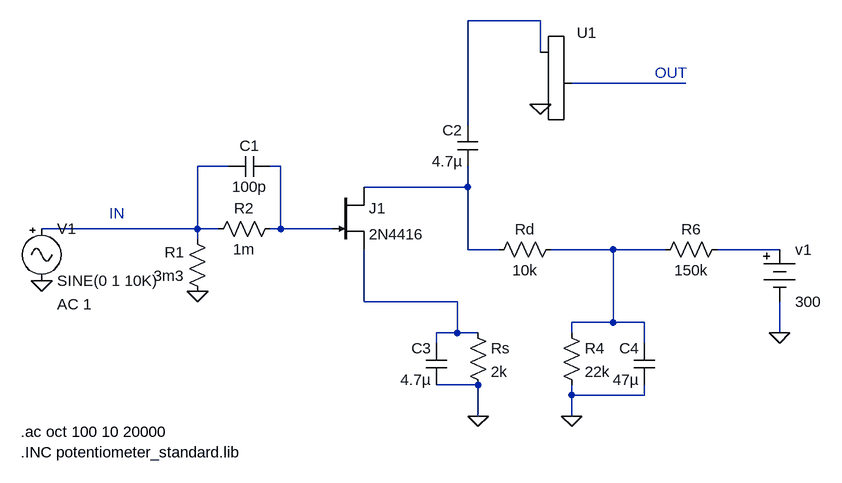
[diagram p0: schematic Dumble FET.asc]
Dumble FET.asc, the LTspice schematic file:
Version 4
SHEET 1 1100 680
WIRE 528 -80 416 -80
WIRE 528 -32 528 -80
WIRE 752 16 576 16
WIRE 416 80 416 -80
WIRE 48 144 0 144
WIRE 128 144 112 144
WIRE 416 176 416 144
WIRE 416 176 256 176
WIRE 0 240 0 144
WIRE 0 240 -240 240
WIRE 32 240 0 240
WIRE 128 240 128 144
WIRE 128 240 112 240
WIRE 208 240 128 240
WIRE 0 256 0 240
WIRE 416 272 416 176
WIRE 464 272 416 272
WIRE 640 272 544 272
WIRE 720 272 640 272
WIRE 896 272 800 272
WIRE 256 352 256 272
WIRE 400 352 256 352
WIRE 640 384 640 272
WIRE 640 384 576 384
WIRE 688 384 640 384
WIRE 400 400 400 352
WIRE 400 400 368 400
WIRE 432 400 400 400
WIRE 576 400 576 384
WIRE 896 400 896 352
WIRE 368 416 368 400
WIRE 688 416 688 384
WIRE 432 480 368 480
WIRE 576 496 576 480
WIRE 688 496 688 480
WIRE 688 496 576 496
WIRE 432 528 432 480
WIRE 576 528 576 496
FLAG 528 48 0
FLAG 576 528 0
FLAG 432 528 0
FLAG 0 336 0
FLAG 896 400 0
FLAG -240 320 0
SYMBOL res 16 352 R180
WINDOW 0 36 76 Left 2
WINDOW 3 36 40 Left 2
SYMATTR InstName R1
SYMATTR Value 3m3
SYMBOL res 16 256 R270
WINDOW 0 32 56 VTop 2
WINDOW 3 0 56 VBottom 2
SYMATTR InstName R2
SYMATTR Value 1m
SYMBOL res 416 384 R0
SYMATTR InstName Rs
SYMATTR Value 2k
SYMBOL res 560 384 R0
SYMATTR InstName R4
SYMATTR Value 22k
SYMBOL res 560 256 R90
WINDOW 0 0 56 VBottom 2
WINDOW 3 32 56 VTop 2
SYMATTR InstName Rd
SYMATTR Value 10k
SYMBOL res 816 256 R90
WINDOW 0 0 56 VBottom 2
WINDOW 3 32 56 VTop 2
SYMATTR InstName R6
SYMATTR Value 150k
SYMATTR SpiceLine pwr=1
SYMBOL cap 112 128 R90
WINDOW 0 0 32 VBottom 2
WINDOW 3 32 32 VTop 2
SYMATTR InstName C1
SYMATTR Value 100p
SYMBOL cap 432 144 R180
WINDOW 0 24 56 Left 2
WINDOW 3 24 8 Left 2
SYMATTR InstName C2
SYMATTR Value 4.7µ
SYMBOL cap 384 480 R180
WINDOW 0 24 56 Left 2
WINDOW 3 24 8 Left 2
SYMATTR InstName C3
SYMATTR Value 4.7µ
SYMBOL cap 704 480 R180
WINDOW 0 24 56 Left 2
WINDOW 3 24 8 Left 2
SYMATTR InstName C4
SYMATTR Value 47µ
SYMBOL potentiometer_standard 512 -48 R0
SYMATTR InstName U1
SYMBOL njf 208 176 R0
SYMATTR InstName J1
SYMATTR Value 2N4416
SYMBOL Misc\\battery 896 256 R0
WINDOW 123 0 0 Left 0
WINDOW 39 0 0 Left 0
SYMATTR InstName v1
SYMATTR Value 300
SYMBOL Misc\\signal -240 224 R0
WINDOW 123 24 132 Left 2
WINDOW 39 0 0 Left 0
SYMATTR Value2 AC 1
SYMATTR InstName V1
SYMATTR Value SINE(0 1 10K)
TEXT -272 552 Left 2 !.ac oct 100 10 20000
TEXT -272 584 Left 2 !.INC potentiometer_standard.lib
TEXT 704 0 Left 2 ;OUT
TEXT -136 216 Left 2 ;IN

The netlist it stands for:
* Dumble FET.asc
R1 0 N003 3m3
R2 N003 N004 1m
Rs N008 0 2k
R4 N006 0 22k
Rd N006 N005 10k
R6 N007 N006 150k pwr=1
C1 N004 N003 100p
C2 N005 N001 4.7µ
C3 0 N008 4.7µ
C4 0 N006 47µ
XU1 N001 0 N002 potentiometer_standard
J1 N005 N004 N008 2N4416
v1 N007 0 300
V1 N003 0 SINE(0 1 10K) AC 1
.model NJF NJF
.model PJF PJF
.lib standard.jft
.ac oct 100 10 20000
.INC potentiometer_standard.lib
* OUT
* IN
.backanno
.end